# Altium schematic sheet POWER_SENSING.SchDoc
size 558 x 431 mm; SheetNumber: 25; SheetTotal: 25; Sheet_Name: POWER; Size: 11x17
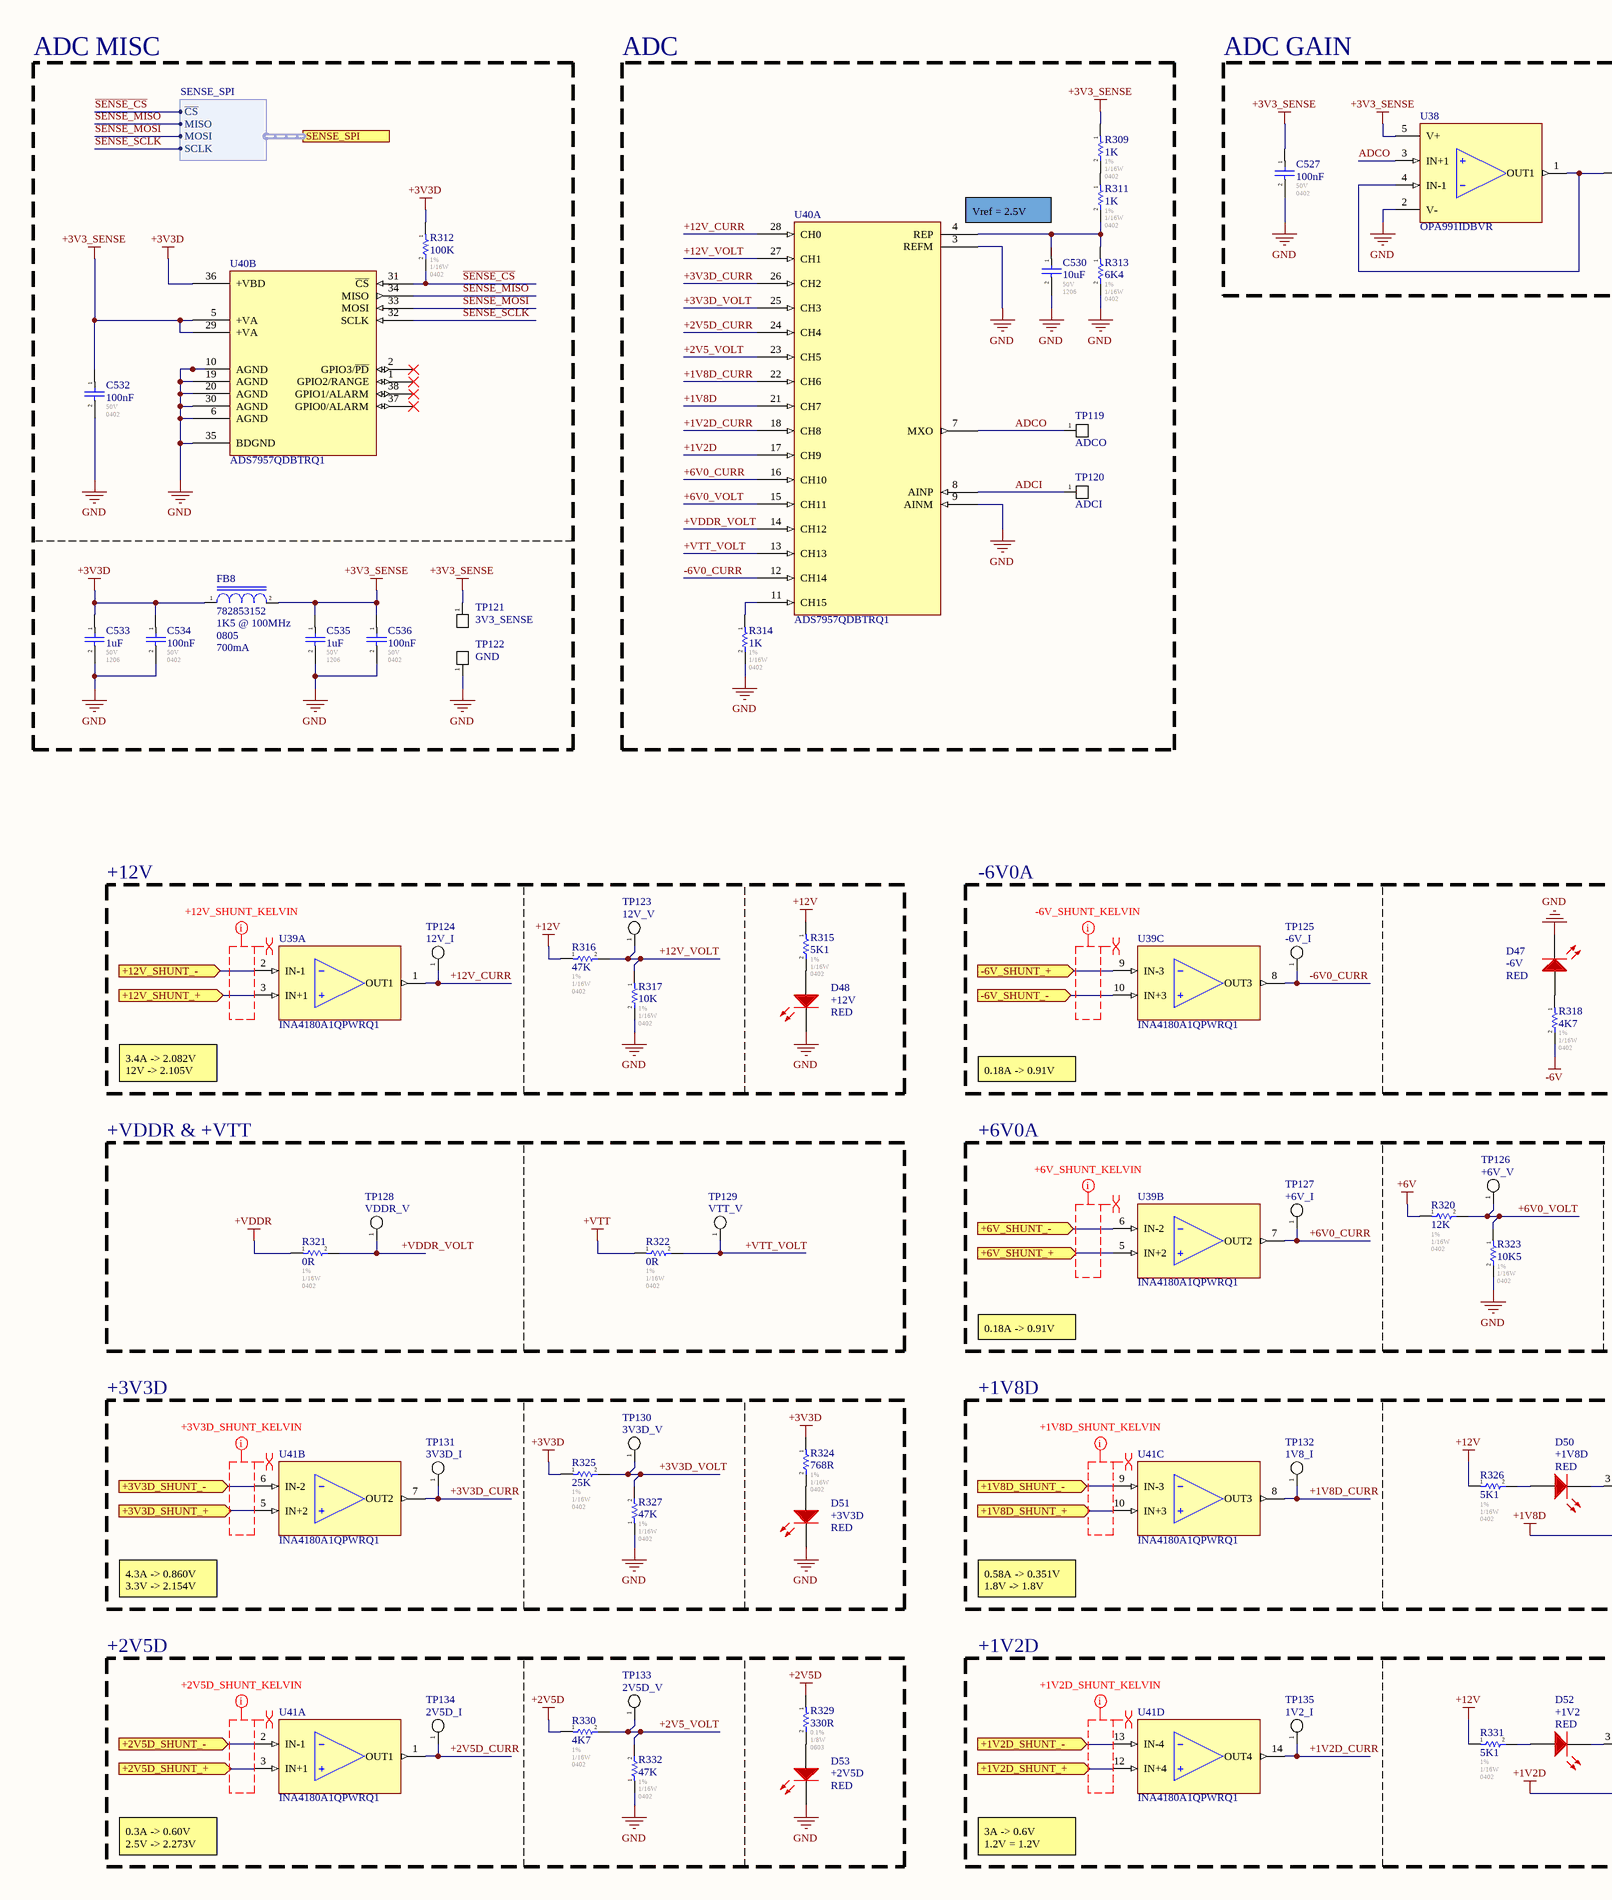
[diagram p0: POWER_SENSING.SchDoc, left]
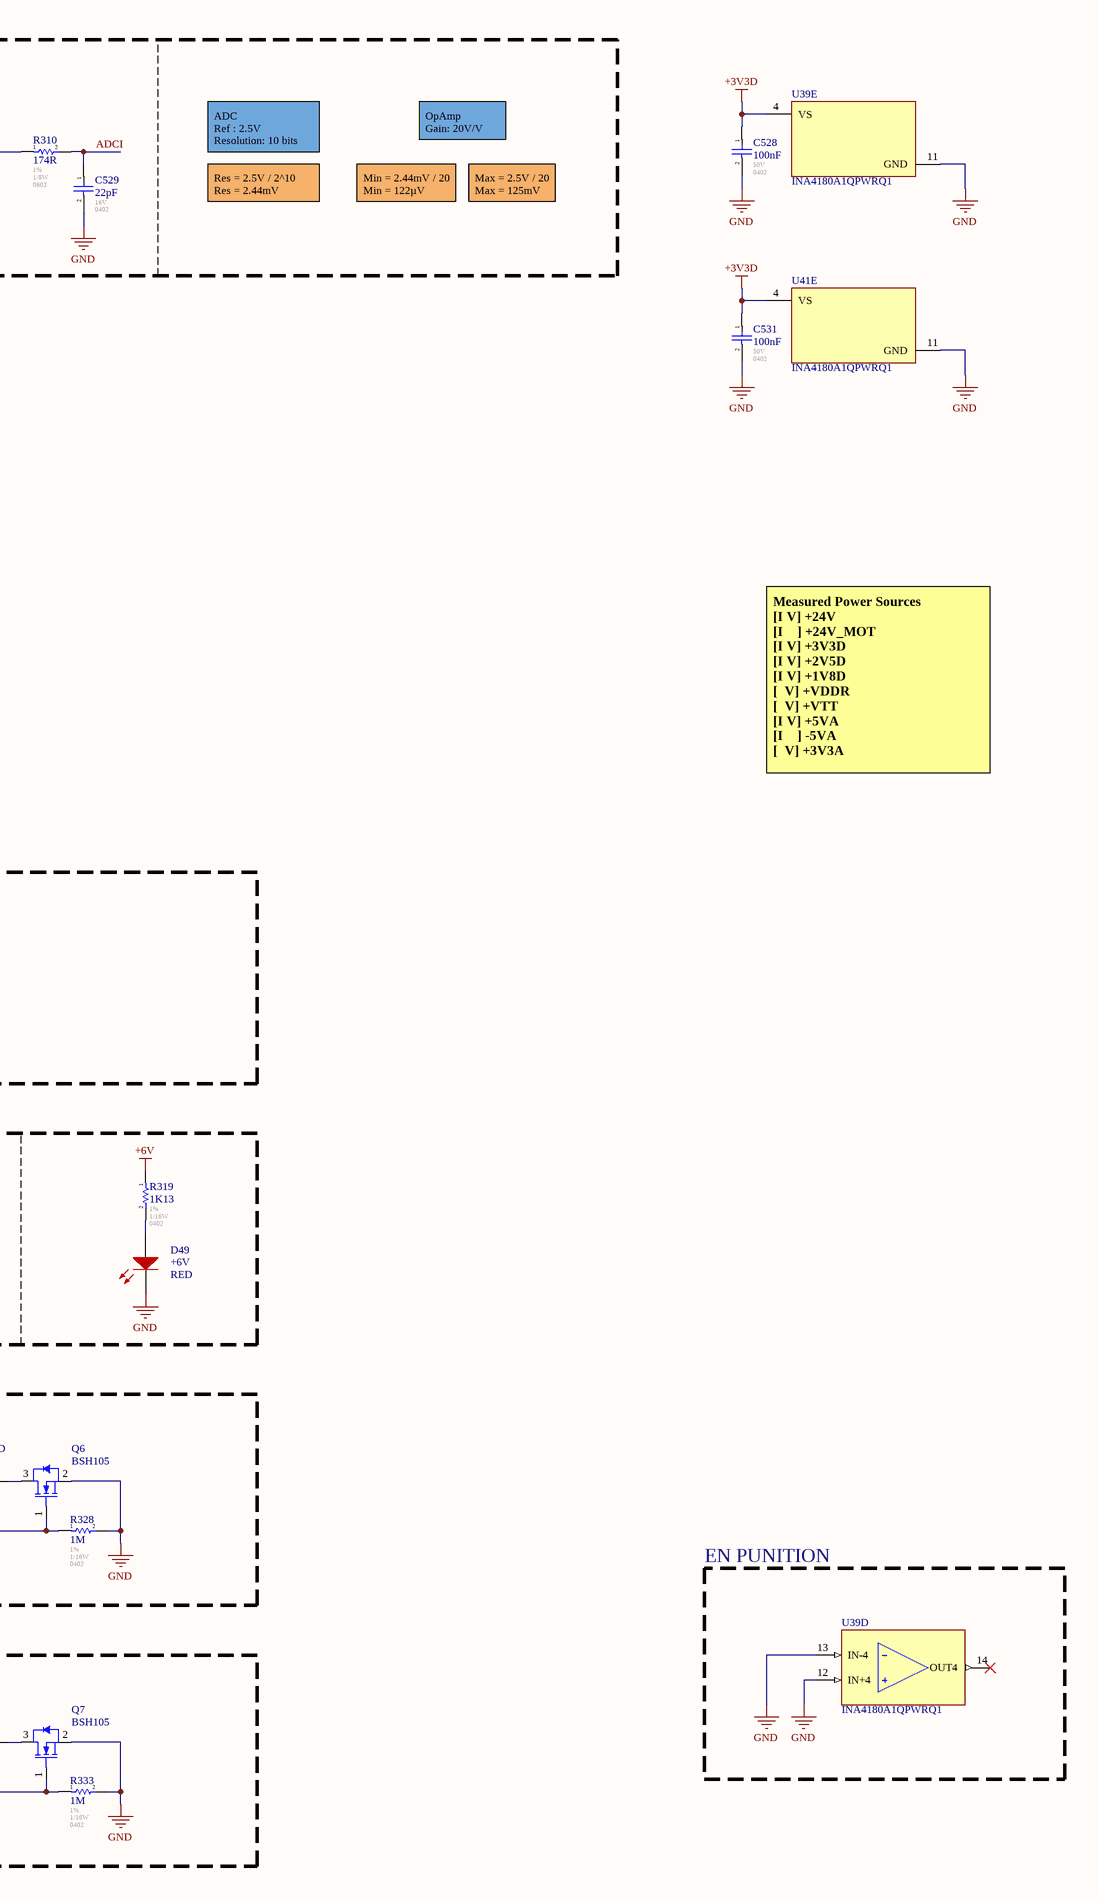
[diagram p1: POWER_SENSING.SchDoc, right]

## Parts
C527  100nF  Voltage - Rated: 50V  Footprint: 0402  [CAP_0402]
C528  100nF  Voltage - Rated: 50V  Footprint: 0402  [CAP_0402]
C529  22pF  Voltage - Rated: 16V  Footprint: 0402  [CAP_0402]
C530  10uF  Voltage - Rated: 50V  Footprint: 1206  [CAP_1206]
C531  100nF  Voltage - Rated: 50V  Footprint: 0402  [CAP_0402]
C532  100nF  Voltage - Rated: 50V  Footprint: 0402  [CAP_0402]
C533  1uF  Voltage - Rated: 50V  Footprint: 1206  [CAP_1206]
C534  100nF  Voltage - Rated: 50V  Footprint: 0402  [CAP_0402]
C535  1uF  Voltage - Rated: 50V  Footprint: 1206  [CAP_1206]
C536  100nF  Voltage - Rated: 50V  Footprint: 0402  [CAP_0402]
D47  -6V  value RED  [LED_0603]
D48  +12V  value RED  [LED_0603]
D49  +6V  value RED  [LED_0603]
D50  +1V8D  value RED  [LED_0603]
D51  +3V3D  value RED  [LED_0603]
D52  +1V2  value RED  [LED_0603]
D53  +2V5D  value RED  [LED_0603]
FB8  782853152  Impedance @ Freq: 1K5 @ 100MHz  Package / Case: 0805  Current Rating: 700mA  [IND_0805]
Q6  BSH105  [SOT23-3]
Q7  BSH105  [SOT23-3]
R309  1K  Tolerance: 1%  Power: 1/16W  Package / Case: 0402  [RES_0402]
R310  174R  Tolerance: 1%  Power: 1/8W  Package / Case: 0603  [RES_0603]
R311  1K  Tolerance: 1%  Power: 1/16W  Package / Case: 0402  [RES_0402]
R312  100K  Tolerance: 1%  Power: 1/16W  Package / Case: 0402  [RES_0402]
R313  6K4  Tolerance: 1%  Power: 1/16W  Package / Case: 0402  [RES_0402]
R314  1K  Tolerance: 1%  Power: 1/16W  Package / Case: 0402  [RES_0402]
R315  5K1  Tolerance: 1%  Power: 1/16W  Package / Case: 0402  [RES_0402]
R316  47K  Tolerance: 1%  Power: 1/16W  Package / Case: 0402  [RES_0402]
R317  10K  Tolerance: 1%  Power: 1/16W  Package / Case: 0402  [RES_0402]
R318  4K7  Tolerance: 1%  Power: 1/16W  Package / Case: 0402  [RES_0402]
R319  1K13  Tolerance: 1%  Power: 1/16W  Package / Case: 0402  [RES_0402]
R320  12K  Tolerance: 1%  Power: 1/16W  Package / Case: 0402  [RES_0402]
R321  0R  Tolerance: 1%  Power: 1/16W  Package / Case: 0402  [RES_0402]
R322  0R  Tolerance: 1%  Power: 1/16W  Package / Case: 0402  [RES_0402]
R323  10K5  Tolerance: 1%  Power: 1/16W  Package / Case: 0402  [RES_0402]
R324  768R  Tolerance: 1%  Power: 1/16W  Package / Case: 0402  [RES_0402]
R325  25K  Tolerance: 1%  Power: 1/16W  Package / Case: 0402  [RES_0402]
R326  5K1  Tolerance: 1%  Power: 1/16W  Package / Case: 0402  [RES_0402]
R327  47K  Tolerance: 1%  Power: 1/16W  Package / Case: 0402  [RES_0402]
R328  1M  Tolerance: 1%  Power: 1/16W  Package / Case: 0402  [RES_0402]
R329  330R  Tolerance: 0.1%  Power: 1/8W  Package / Case: 0603  [RES_0603]
R330  4K7  Tolerance: 1%  Power: 1/16W  Package / Case: 0402  [RES_0402]
R331  5K1  Tolerance: 1%  Power: 1/16W  Package / Case: 0402  [RES_0402]
R332  47K  Tolerance: 1%  Power: 1/16W  Package / Case: 0402  [RES_0402]
R333  1M  Tolerance: 1%  Power: 1/16W  Package / Case: 0402  [RES_0402]
TP119  ADCO  [TP_PAD]  (no BOM)
TP120  ADCI  [TP_PAD]  (no BOM)
TP121  3V3_SENSE  [TP_PAD]  (no BOM)
TP122  GND  [TP_PAD]  (no BOM)
TP123  12V_V  [TP_PAD_SMALL]  (no BOM)
TP124  12V_I  [TP_PAD_SMALL]  (no BOM)
TP125  -6V_I  [TP_PAD_SMALL]  (no BOM)
TP126  +6V_V  [TP_PAD_SMALL]  (no BOM)
TP127  +6V_I  [TP_PAD_SMALL]  (no BOM)
TP128  VDDR_V  [TP_PAD_SMALL]  (no BOM)
TP129  VTT_V  [TP_PAD_SMALL]  (no BOM)
TP130  3V3D_V  [TP_PAD_SMALL]  (no BOM)
TP131  3V3D_I  [TP_PAD_SMALL]  (no BOM)
TP132  1V8_I  [TP_PAD_SMALL]  (no BOM)
TP133  2V5D_V  [TP_PAD_SMALL]  (no BOM)
TP134  2V5D_I  [TP_PAD_SMALL]  (no BOM)
TP135  1V2_I  [TP_PAD_SMALL]  (no BOM)
U38  OPA991IDBVR  [SOT23-5]
U39  INA4180A1QPWRQ1  [TSSOP-14_4.4MM]  (parts A,B,C,D,E of 5)
U40  ADS7957QDBTRQ1  [TSSOP-38_4.4MM]  (parts A,B of 2)
U41  INA4180A1QPWRQ1  [TSSOP-14_4.4MM]  (parts A,B,C,D,E of 5)

## Blocks framed on the sheet
ADC MISC: C532-C536 FB8 R312 TP121 TP122 U40
ADC: C530 R309 R311 R313 R314 TP119 TP120 U40
ADC GAIN: C527 C529 R310 U38
+12V: D48 R315-R317 TP123 TP124 U39
-6V0A: D47 R318 TP125 U39
+VDDR & +VTT: R321 R322 TP128 TP129
+6V0A: D49 R319 R320 R323 TP126 TP127 U39
+3V3D: D51 R324 R325 R327 TP130 TP131 U41
+1V8D: D50 Q6 R326 R328 TP132 U41
EN PUNITION: U39
+2V5D: D53 R329 R330 R332 TP133 TP134 U41
+1V2D: D52 Q7 R331 R333 TP135 U41

## Ports
+1V2D_SHUNT_+ (in), +1V2D_SHUNT_- (in), +1V8D_SHUNT_+ (in), +1V8D_SHUNT_- (in), +2V5D_SHUNT_+ (in), +2V5D_SHUNT_- (in), +3V3D_SHUNT_+ (in), +3V3D_SHUNT_- (in), +6V_SHUNT_+ (in), +6V_SHUNT_- (in), +12V_SHUNT_+ (in), +12V_SHUNT_- (in), -6V_SHUNT_+ (in), -6V_SHUNT_- (in), SENSE_SPI (harness SENSE_SPI)

## Harnesses
SENSE_SPI: ~{CS}, MISO, MOSI, SCLK

## Nets
+1V2D: Q7.1(G) R333.1 U40.17(CH9)
+1V8D: Q6.1(G) R328.1 U40.21(CH7)
+2V5D: R329.1 R330.1
+3V3_SENSE: C527.1 C532.1 C535.1 C536.1 FB8.2 R309.1 TP121.1(A) U38.5(V+) U40.5(+VA) U40.29(+VA)
+3V3D: C528.1 C531.1 C533.1 C534.1 FB8.1 R312.1 R324.1 R325.1 U39.4(VS) U40.36(+VBD) U41.4(VS)
+6V: R319.1 R320.1
+12V: R315.1 R316.1 R326.1 R331.1
+VDDR: R321.1
+VTT: R322.1
-6V: R318.2
GND: C527.2 C528.2 C529.2 C530.2 C531.2 C532.2 C533.2 C534.2 C535.2 C536.2 D47.2(K) D48.2(K) D49.2(K) D51.2(K) D53.2(K) Q6.2(S) Q7.2(S) R313.2 R314.2 R317.2 R323.2 R327.1 R328.2 R332.1 R333.2 TP122.1(A) U38.2(V-) U39.11(GND) U39.12(IN+4) U39.13(IN-4) U40.3(REFM) U40.6(AGND) U40.9(AINM) U40.10(AGND) U40.19(AGND) U40.20(AGND) U40.30(AGND) U40.35(BDGND) U41.11(GND)
+1V2D_CURR: TP135.1(A) U40.18(CH8) U41.14(OUT4)
+1V2D_SHUNT_+: U41.12(IN+4) ; port +1V2D_SHUNT_+
+1V2D_SHUNT_-: U41.13(IN-4) ; port +1V2D_SHUNT_-
+1V8D_CURR: TP132.1(A) U40.22(CH6) U41.8(OUT3)
+1V8D_SHUNT_+: U41.10(IN+3) ; port +1V8D_SHUNT_+
+1V8D_SHUNT_-: U41.9(IN-3) ; port +1V8D_SHUNT_-
+2V5_VOLT: R330.2 R332.2 TP133.1(A) U40.23(CH5)
+2V5D_CURR: TP134.1(A) U40.24(CH4) U41.1(OUT1)
+2V5D_SHUNT_+: U41.3(IN+1) ; port +2V5D_SHUNT_+
+2V5D_SHUNT_-: U41.2(IN-1) ; port +2V5D_SHUNT_-
+3V3D_CURR: TP131.1(A) U40.26(CH2) U41.7(OUT2)
+3V3D_SHUNT_+: U41.5(IN+2) ; port +3V3D_SHUNT_+
+3V3D_SHUNT_-: U41.6(IN-2) ; port +3V3D_SHUNT_-
+3V3D_VOLT: R325.2 R327.2 TP130.1(A) U40.25(CH3)
+6V0_CURR: TP127.1(A) U39.7(OUT2) U40.16(CH10)
+6V0_VOLT: R320.2 R323.1 TP126.1(A) U40.15(CH11)
+6V_SHUNT_+: U39.5(IN+2) ; port +6V_SHUNT_+
+6V_SHUNT_-: U39.6(IN-2) ; port +6V_SHUNT_-
+12V_CURR: TP124.1(A) U39.1(OUT1) U40.28(CH0)
+12V_SHUNT_+: U39.3(IN+1) ; port +12V_SHUNT_+
+12V_SHUNT_-: U39.2(IN-1) ; port +12V_SHUNT_-
+12V_VOLT: R316.2 R317.1 TP123.1(A) U40.27(CH1)
+VDDR_VOLT: R321.2 TP128.1(A) U40.14(CH12)
+VTT_VOLT: R322.2 TP129.1(A) U40.13(CH13)
-6V0_CURR: TP125.1(A) U39.8(OUT3) U40.12(CH14)
-6V_SHUNT_+: U39.9(IN-3) ; port -6V_SHUNT_+
-6V_SHUNT_-: U39.10(IN+3) ; port -6V_SHUNT_-
~{SENSE_CS}: R312.2 U40.31(~{CS}) ; port SENSE_SPI.~{CS}
ADCI: C529.1 R310.2 TP120.1(A) U40.8(AINP)
ADCO: TP119.1(A) U38.3(IN+1) U40.7(MXO)
SENSE_MISO: U40.34(MISO) ; port SENSE_SPI.MISO
SENSE_MOSI: U40.33(MOSI) ; port SENSE_SPI.MOSI
SENSE_SCLK: U40.32(SCLK) ; port SENSE_SPI.SCLK
NetC530_1: C530.1 R311.2 R313.1 U40.4(REP)
NetD47_1: D47.1(A) R318.1
NetD48_1: D48.1(A) R315.2
NetD49_1: D49.1(A) R319.2
NetD50_1: D50.1(A) R326.2
NetD50_2: D50.2(K) Q6.3(D)
NetD51_1: D51.1(A) R324.2
NetD52_1: D52.1(A) R331.2
NetD52_2: D52.2(K) Q7.3(D)
NetD53_1: D53.1(A) R329.2
NetR309_2: R309.2 R311.1
NetR310_1: R310.1 U38.1(OUT1) U38.4(IN-1)
NetR314_1: R314.1 U40.11(CH15)

Not connected (* = marked no-connect by the designer): U39 14(OUT4)*; U40 1(GPIO2/RANGE)* 2(GPIO3/~{PD})* 37(GPIO0/ALARM)* 38(GPIO1/ALARM)*

## Layout directives
net class +12V_SHUNT_KELVIN: (no net found under the mark)
net class +3V3D_SHUNT_KELVIN: (no net found under the mark)
net class +2V5D_SHUNT_KELVIN: (no net found under the mark)
net class +1V8D_SHUNT_KELVIN: (no net found under the mark)
net class +6V_SHUNT_KELVIN: (no net found under the mark)
net class -6V_SHUNT_KELVIN: (no net found under the mark)
net class +1V2D_SHUNT_KELVIN: (no net found under the mark)
differential pair: (no net found under the mark)

## Notes on the sheet
- ADC
  Ref : 2.5V
  Resolution: 10 bits
- OpAmp
  Gain: 20V/V
- Vref = 2.5V
- Res = 2.5V / 2^10
  Res = 2.44mV
- Min = 2.44mV / 20
  Min = 122µV
- Max = 2.5V / 20
  Max = 125mV
- Measured Power Sources
  [I V] +24V
  [I    ] +24V_MOT
  [I V] +3V3D
  [I V] +2V5D
  [I V] +1V8D
  [  V] +VDDR
  [  V] +VTT
  [I V] +5VA
  [I    ] -5VA
  [  V] +3V3A
- 3.4A -> 2.082V
  12V -> 2.105V
- 0.18A -> 0.91V
- 4.3A -> 0.860V
  3.3V -> 2.154V
- 0.58A -> 0.351V
  1.8V -> 1.8V
- 0.3A -> 0.60V
  2.5V -> 2.273V
- 3A -> 0.6V
  1.2V = 1.2V
- Sheet Name
- Project Title
- Global Project
- Revision
- Size
- Date
- Group
- Sheet
- of
- Filename
- Designers

## Library data of the parts
C527 C528 C531 C532 C534 C536 = CAP_CER: GCM155R71H104KE02J / 0402 100nF 10% X7R Ceramic Capacitor; Mfr: Murata; Operating Temperature: -55C - 125C; Temperature Coefficient: X7R; ComponentLink1Description: Digikey; ComponentLink1URL: [Digikey Link]; Part#: GCM155R71H104KE02J; ComponentLink2Description: Datasheet; ComponentLink2URL: [Datasheet Link]; Tolerance: 10%; Ratings: AEC-Q200
C529 = CAP_CER: 0402 22pF 10% X7R 16V Ceramic Capacitor / C0402C220K4RACAUTO; Mfr: KEMET; Operating Temperature: -55C - 125C; Temperature Coefficient: X7R; ComponentLink1Description: Digikey; ComponentLink1URL: https://www.digikey.ca/en/products/detail/kemet/c0402c220k4racauto/11676432; Part#: C0402C220K4RACAUTO; ComponentLink2Description: Datasheet; ComponentLink2URL: https://connect.kemet.com:7667/gateway/IntelliData-ComponentDocumentation/1.0/download/datasheet/C0402C220K4RACAUTO; Tolerance: 10%; Ratings: AEC-Q200; ComponentLink3Description: Octopart; ComponentLink3URL: https://octopart.com/c0402c220k4racauto-kemet-91893749?r=sp; ComponentLink4Description: Kemet; ComponentLink4URL: https://www.kemet.com/en/us/capacitors/ceramic/product/C0402C220K4RACAUTO.html; ComponentLink5Description: Specsheet; ComponentLink5URL: https://search.kemet.com/component-documentation/download/specsheet/C0402C220K4RACAUTO; Supplier 1: Mouser; Supplier Part Number 1: 80-C0402C220K4RAUTO
C530 = CAP_CER: GRT31CR61H106KE01L / 1206 10uF 10% X5R Ceramic Capacitor; Mfr: Murata; Operating Temperature: -55C - 85C; Temperature Coefficient: X5R; ComponentLink1Description: Digikey; ComponentLink1URL: [Digikey Link]; ComponentLink2Description: Datasheet; ComponentLink2URL: [Datasheet Link]; Tolerance: 10%; Ratings: AEC-Q200; Supplier 1: Arrow Electronics; Supplier Part Number 1: GRT31CR61H106KE01L; Part#: GRT31CR61H106KE01L
C533 C535 = CAP_CER: GCJ31CR71H105KA12L / 1206 1uF 10% X7R Ceramic Capacitor; Mfr: Murata; Operating Temperature: -55C - 125C; Temperature Coefficient: X7R; ComponentLink1Description: Digikey; ComponentLink1URL: [Digikey Link]; Part#: GCJ31CR71H105KA12L; ComponentLink2Description: Datasheet; ComponentLink2URL: [Datasheet Link]; Tolerance: 10%; Ratings: AEC-Q200
D47-D53 = LED_SML-311UTT86: LED - 620nM RED 2mA - 0603; Voltage: 1.8V; Mfg: ROHM Semiconductor; Power: 44mW; Current: 2mA; HelpURL: http://media.digikey.com/pdf/Data%20Sheets/Rohm%20PDFs/SML-311%20Series.pdf; CreatedBy: Jonathan Bouchard; Temperature: -30°C to 85°C; Package: 0603; Precision: *; Mfg Part Number: SML-311UTT86; Supplier 1: Digikey; Supplier Part Number 1: 511-1304-1-ND
FB8 = FERRITE_BEAD: 600 Ohms @ 100 MHz 1 Signal Line Ferrite Bead 0603 (1608 Metric) 1A 200mOhm; Manufacturer: Wurth Elektronik; Resistance: 350mR; Operating Temperature: -55C - 125C; Rating: AEC-Q200; ComponentLink1Description: Digikey; ComponentLink1URL: https://www.digikey.ca/en/products/detail/w%C3%BCrth-elektronik/782853152/5168812; ComponentLink3Description: Octopart; ComponentLink3URL: https://octopart.com/782853152-wurth+elektronik-56466774?r=sp; ComponentLink5Description: Datasheet; ComponentLink5URL: https://www.we-online.com/en/components/products/datasheet/782853152.pdf
Q6 Q7 = TRX_NMOS_SI2310-TP: Manufacturer #1: Micro Commercial Co; Current Rating: 3A; Power Max: 350mW; Voltage rating: 60V (Vds max), 2V (Vgs @ 250uA); Polarized: Yes; Magnetic Material: UNKNOWN; GRAMS Lib Spec: 2.8c; Manufacturer #2: *; Value: *; Part Number #1: SI2310-TP; Part Number #2: *; HelpURL: https://www.mccsemi.com/pdf/Products/SI2310(SOT-23)-A.pdf; Assembly Type: SMD; Temperature: -55°C ~ 150°C (TJ); Package: SOT-23; CreatedBy/Date: Louis-Daniel Gaulin / 20-02-2020; Tolerance: *; VerifiedBy: C.Paulin - 21/02/2020; Cryo: UNKNOWN; Supplier 1: Avnet; Supplier Part Number 1: BSH105,215
R309-R327 R330-R332 = RESISTOR: Automotive: AEC-Q200; Operating Temperature: *; # Digikey: *; ComponentLink1Description: Digikey; ComponentLink1URL: *; # Manufacturer: *
R328 R333 = RESISTOR: 1M 0402 1% 1/16W Resistor; Automotive: AEC-Q200; Operating Temperature: *; # Digikey: *; ComponentLink1Description: Digikey; ComponentLink1URL: *; # Manufacturer: *
R329 = RESISTOR: 1M 0603 1% 1/16W Resistor; Automotive: AEC-Q200; Operating Temperature: *; # Digikey: *; ComponentLink1Description: Digikey; ComponentLink1URL: *; # Manufacturer: *
TP119-TP122 = TESTPOINT_PAD: Test Point
TP123-TP135 = TESTPOINT_PAD_SMALL: Test Point
U38 = OPA991IDBVR: General Purpose Amplifier 1 Circuit Rail-to-Rail SOT-23-5; Mfr: Texas Instruments; Voltage - Supply (Min): 2.7V; Voltage - Supply (Max): 40V; Voltage - Input Offset: 125µV; Current - Input Bias: 10pA; Slew Rate: 21V/µs; Current - Output: 75mA; Part#: OPA991IDBVR; Output Type: Rail-to-Rail; Operating Temperature: -40C - 125C; ComponentLink1Description: Digikey; ComponentLink1URL: https://www.digikey.ca/en/products/detail/texas-instruments/OPA991IDBVR/13174045; ComponentLink2Description: Datasheet; ComponentLink2URL: https://www.ti.com/lit/ds/symlink/opa991.pdf; ComponentLink3Description: Texas Instruments; ComponentLink3URL: https://www.ti.com/product/OPA991/part-details/OPA991IDBVR; ComponentLink4Description: Octopart; ComponentLink4URL: https://octopart.com/search?q=OPA991IDBVR&autosugg_idx=0&currency=USD&specs=0; Supplier 1: Mouser; Supplier Part Number 1: 595-OPA991IDBVR
U39 U41 = INA4180A1QPWRQ1: Current Sense Amplifier 4 Circuit Differential, Rail-to-Rail 14-TSSOP; Mfr: Texas Instruments; Voltage - Supply (Min): 2.7V; Voltage - Supply (Max): 5.5V; Gain Bandwidth Product: 350kHz; Current - Input Bias: -100nA; Voltage - Input Offset: 100uV; Current - Output / Channel: 8mA; Gain: 20V/V; Voltage - Analog Input (Max): 26V; ComponentLink1Description: Digikey; ComponentLink1URL: https://www.digikey.com/en/products/detail/texas-instruments/INA4180A1QPWRQ1/9654220; ComponentLink2Description: Datasheet; ComponentLink2URL: https://www.ti.com/lit/ds/symlink/ina4180-q1.pdf; ComponentLink3Description: Octopart; ComponentLink3URL: https://octopart.com/ina4180a1qpwrq1-texas+instruments-94354202?r=sp; ComponentLink4Description: Texas Instruments; ComponentLink4URL: https://www.ti.com/product/INA4180-Q1/part-details/INA4180A1QPWRQ1; Operating Temperature: -40C - 125C; Ratings: AEC-Q100; Supplier 1: Mouser; Supplier Part Number 1: 595-INA4180A1QPWRQ1
U40 = ADS7957QDBTRQ1: 10 Bit Analog to Digital Converter 16 Input 1 SAR 38-TSSOP; Mfr: Texas Instruments; Number of Bits: 10; Number of Inputs: 16; Sampling Rate: 1M; Input Type: Single Ended; Supply Voltage - Analog (Min): 2.7V; Supply Voltage - Analog (Max): 5.25V; Supply Voltage - Digital (Min): 1.7V; Supply Voltage - Digital (Max): 5.25; Qualification: AEC-Q100; Part#: ADS7957QDBTRQ1; Architecture: SAR; Operating Temperature: -40C - 125C; ComponentLink1Description: Digikey; ComponentLink1URL: https://www.digikey.ca/en/products/detail/texas-instruments/ADS7957QDBTRQ1/4860369; ComponentLink2Description: Datasheet; ComponentLink2URL: https://www.ti.com/lit/ds/symlink/ads7957-q1.pdf; ComponentLink3Description: Texas Instruments; ComponentLink3URL: https://www.ti.com/product/ADS7957-Q1/part-details/ADS7957QDBTRQ1; ComponentLink4Description: Octopart; ComponentLink4URL: https://octopart.com/ads7957qdbtrq1-texas+instruments-43172431?r=sp; Supplier 1: Mouser; Supplier Part Number 1: 595-ADS7957QDBTRQ1